# EAGLE design Lügendetektor (EAGLE 7.2.0)
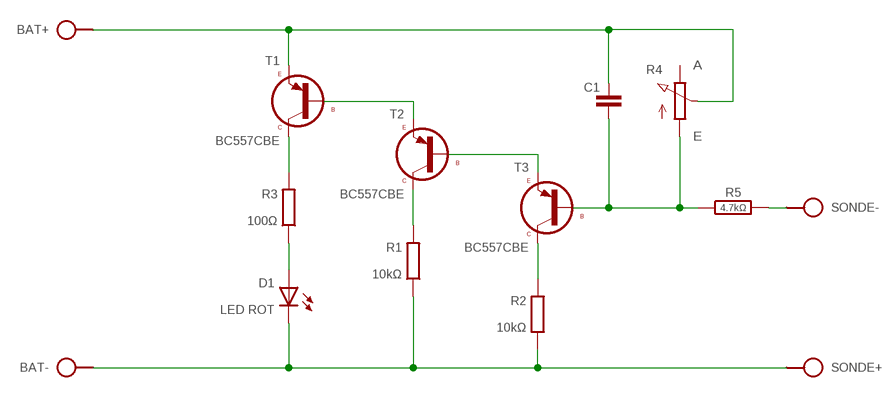
[diagram p0: schematic, sheet 1]

## Parts
BAT  SPAD+-+-  [SPAD+-]
C1  C050-020X044/V  [C050-020X044/V]
D1  LED ROT  LED-3MM/V  [LED_3MM/V]
R1  10kΩ  R0204/10-V  [0204/10-V]
R2  10kΩ  R0204/10-V  [0204/10-V]
R3  100Ω  R0204/10-V  [0204/10-V]
R4  POT-V  [POT-V]
R5  4.7kΩ  R-H0204/10  [0204/10]
SONDE  SPAD+-+-  [SPAD+-]
T1  BC557CBE  [TO92-CBE]
T2  BC557CBE  [TO92-CBE]
T3  BC557CBE  [TO92-CBE]

## Nets
N$1: R3.1 T1.1(C)
N$2: D1.A R3.2
N$3: R1.1 T2.1(C)
N$4: R2.1 T3.1(C)
N$5: BAT.1 D1.K(C) R1.2 R2.2 SONDE.2
N$6: BAT.2 C1.1 R4.S T1.3(E)
N$7: T1.2(B) T2.3(E)
N$8: T2.2(B) T3.3(E)
N$9: R5.2 SONDE.1
N$12: C1.2 R4.A R5.1 T3.2(B)
Unconnected: R4.E

## Library data of the parts
BAT SONDE = pad:SPAD+-
C1 = c:C: CAPACITOR, European symbol
D1 = d:LED
R1-R3 = r:R: RESISTOR, European symbol
R4 = r:POT
R5 = r:R-H
T1-T3 = t:BC557

## Board
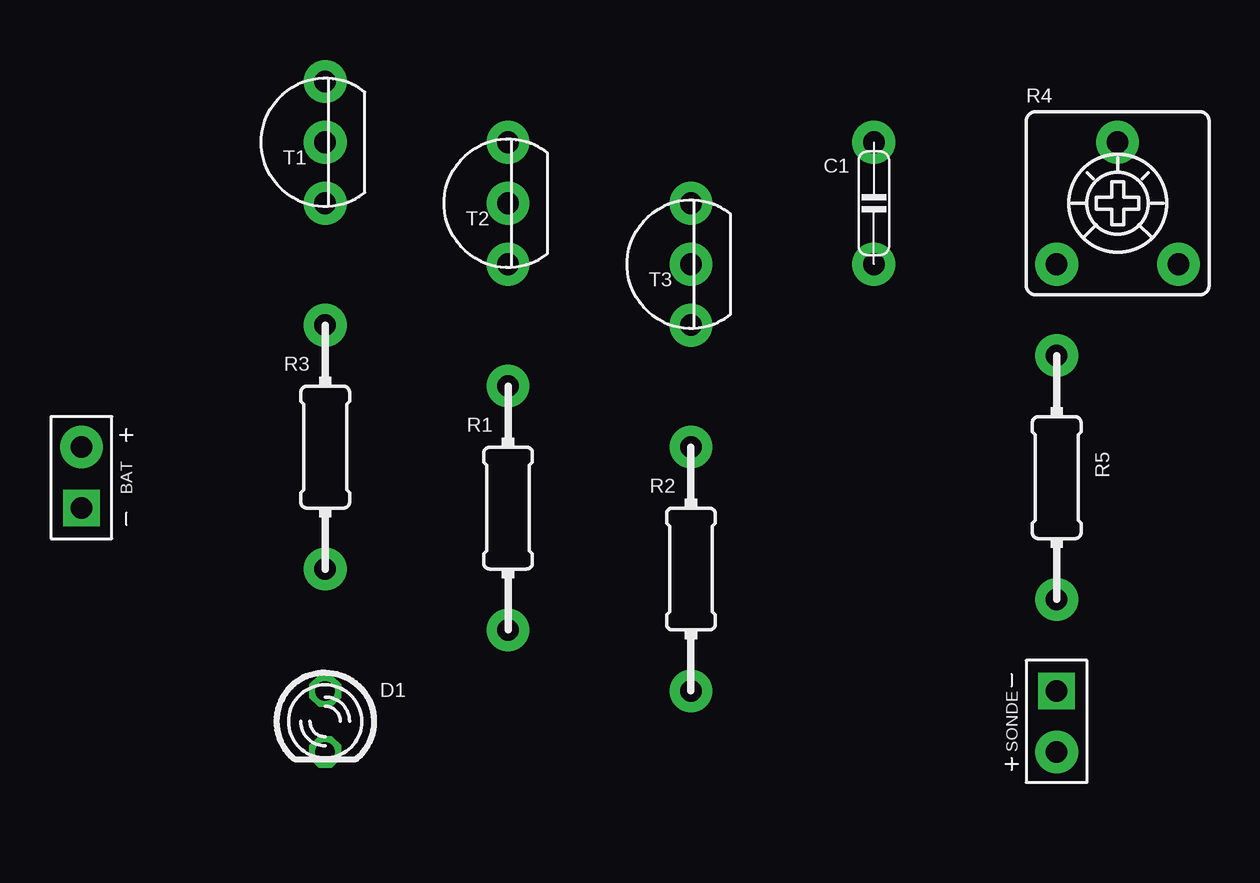
[diagram p1: board, top side]
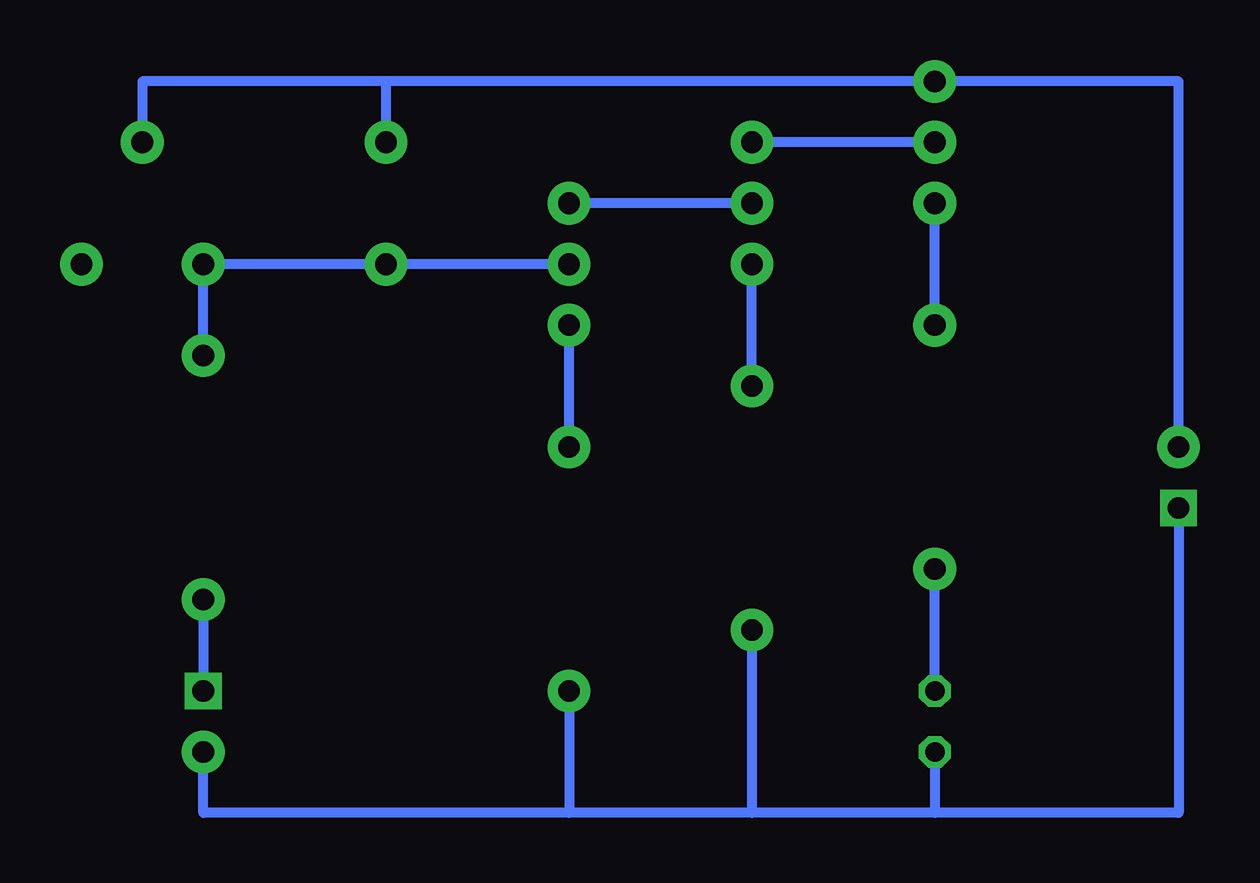
[diagram p2: board, bottom side, seen from below]

No outline drawn. Coordinates in mm, seen from the top.
Copper layers (1*16): Top 0.035mm / dielectric 1.5mm / Bottom 0.035mm
Design rules "default": minimum track width 10mil, minimum drill 24mil, track to track 8mil, track to pad 8mil, pad to pad 8mil, via to via 8mil, smd to smd 8mil, copper to edge 40mil, drill to drill 8mil, minimum pad ring 10mil, minimum via ring 8mil, stop-mask expansion 4mil, vias tented up to drill 0mil, thermal gap 10mil

### Footprints (pad centres in the part's own frame; a part is rotated, then mirrored left to right if it is on the bottom)
SPAD+- = drill 0.9 pad 1.524 square: 1 0,-1.27 | drill 0.9 pad 1.778: 2 0,1.27
C050-020X044/V = drill 0.9 pad 1.778: 1 0,2.54; 2 0,-2.54
LED_3MM/V = drill 0.813 pad 1.27 octagon: A 0,1.27; K 0,-1.27
0204/10-V = drill 0.9 pad 1.778: 1 0,5.08; 2 0,-5.08
POT-V = drill 0.9 pad 1.778: A -2.54,-2.54; E 2.54,-2.54; S 0,2.54
0204/10 = drill 0.9 pad 1.778: 1 -5.08,0; 2 5.08,0
TO92-CBE = drill 0.9 pad 1.778: 1 0,2.54; 2 0,0; 3 0,-2.54

### Placement (x,y rotation side)
BAT  -7.62,19.05 0 top
C1  25.4,30.48 0 top
D1  2.54,8.89 0 top
R1  10.16,17.78 0 top
R2  17.78,15.24 0 top
R3  2.54,20.32 0 top
R4  35.56,30.48 0 top
R5  33.02,19.05 270 top
SONDE  33.02,8.89 180 top
T1  2.54,33.02 180 top
T2  10.16,30.48 180 top
T3  17.78,27.94 180 top

### Tracks (layer width: path | path; a pad name or v marks a point on that pad's centre or on a via)
N$1
  Bottom 0.406: R3.1 T1.1
N$2
  Bottom 0.406: D1.A R3.2
N$3
  Bottom 0.406: R1.1 T2.1
N$4
  Bottom 0.406: R2.1 T3.1
N$5
  Bottom 0.406: D1.K 2.54,5.08 | 2.54,5.08 10.16,5.08 | R1.2 10.16,5.08 | 10.16,5.08 17.78,5.08 | R2.2 17.78,5.08 | 17.78,5.08 33.02,5.08 SONDE.2 | BAT.1 -7.62,5.08 2.54,5.08
N$6
  Bottom 0.406: 25.4,35.56 T1.3 -7.62,35.56 BAT.2 | C1.1 25.4,35.56 | 25.4,35.56 35.56,35.56 R4.S
N$7
  Bottom 0.406: T1.2 T2.3
N$8
  Bottom 0.406: T2.2 T3.3
N$9
  Bottom 0.406: R5.2 SONDE.1
N$12
  Bottom 0.406: T3.2 C1.2 R4.A R5.1